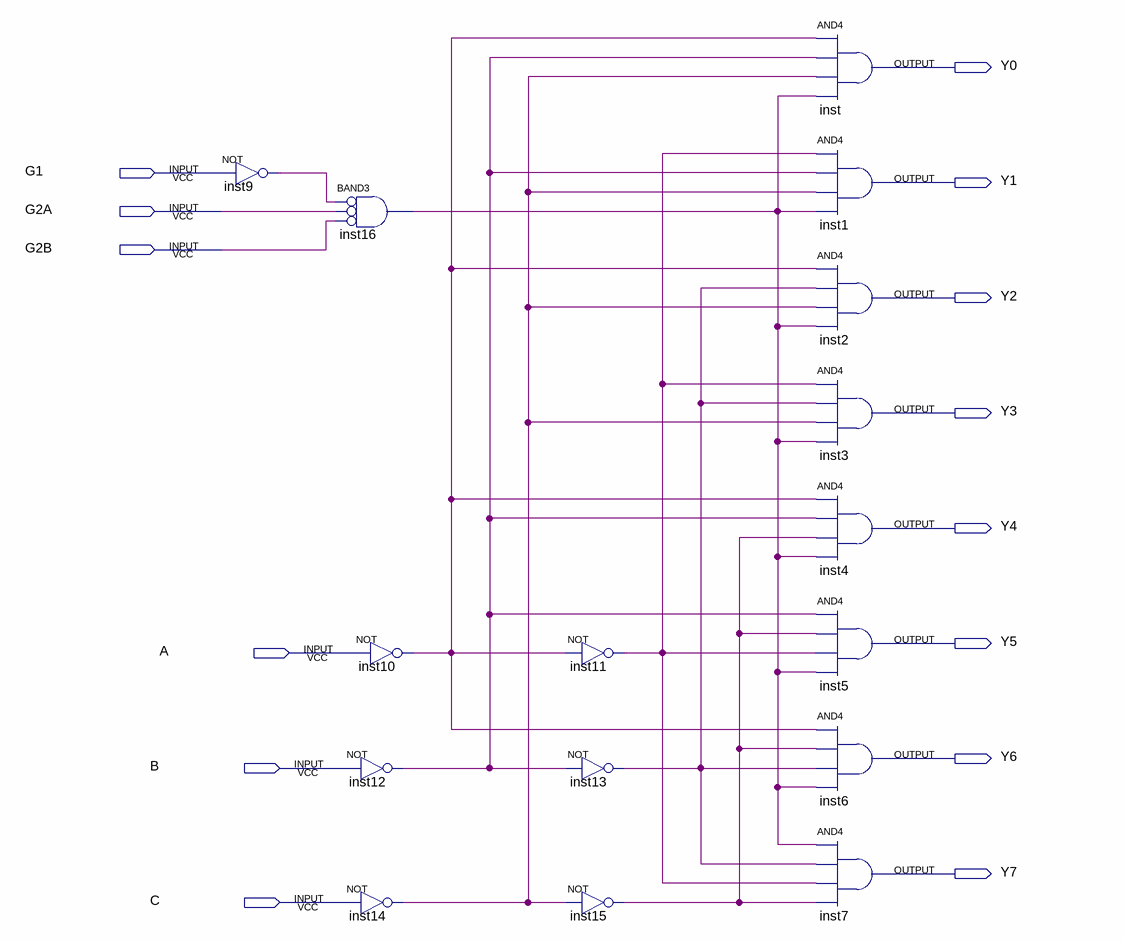
[diagram p0: schematic sheet]
// Quartus schematic ci_74LS138.bdf as structural Verilog: 16 symbols, 14 pins
module ci_74LS138 (
  input  G1,
  input  G2A,
  input  G2B,
  input  A,
  input  B,
  input  C,
  output Y0,
  output Y1,
  output Y2,
  output Y3,
  output Y4,
  output Y5,
  output Y6,
  output Y7
);

  wire inst9_out, inst10_out, inst11_out, inst12_out, inst13_out, inst14_out, inst15_out, inst16_out;

  not inst9 (inst9_out, G1);
  and inst16 (inst16_out, ~inst9_out, ~G2A, ~G2B);  // BAND3
  not inst10 (inst10_out, A);
  not inst12 (inst12_out, B);
  not inst14 (inst14_out, C);
  not inst11 (inst11_out, inst10_out);
  not inst13 (inst13_out, inst12_out);
  not inst15 (inst15_out, inst14_out);
  and inst (Y0, inst10_out, inst12_out, inst14_out, inst16_out);
  and inst1 (Y1, inst11_out, inst12_out, inst14_out, inst16_out);
  and inst2 (Y2, inst10_out, inst13_out, inst14_out, inst16_out);
  and inst3 (Y3, inst11_out, inst13_out, inst14_out, inst16_out);
  and inst4 (Y4, inst10_out, inst12_out, inst15_out, inst16_out);
  and inst5 (Y5, inst12_out, inst15_out, inst11_out, inst16_out);
  and inst6 (Y6, inst10_out, inst15_out, inst13_out, inst16_out);
  and inst7 (Y7, inst16_out, inst13_out, inst11_out, inst15_out);
endmodule
